# EAGLE design RCMX Rev_00_BPS (EAGLE 6.2)
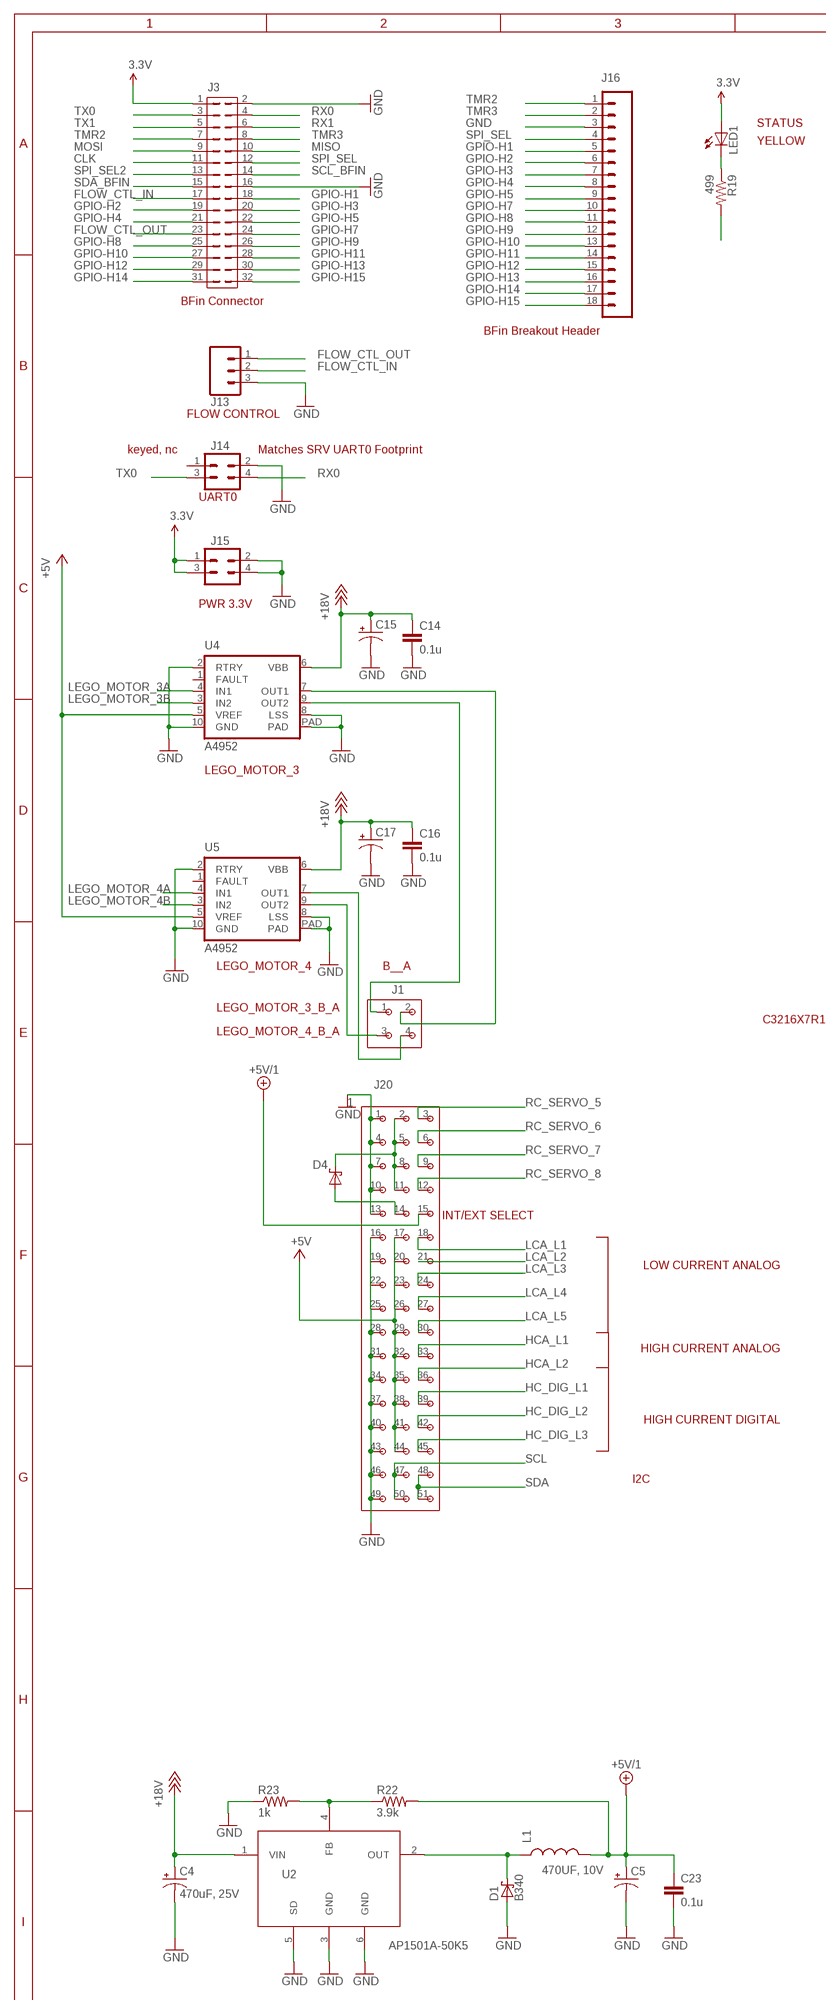
[diagram p0: schematic, sheet 1, part 1 of 2]
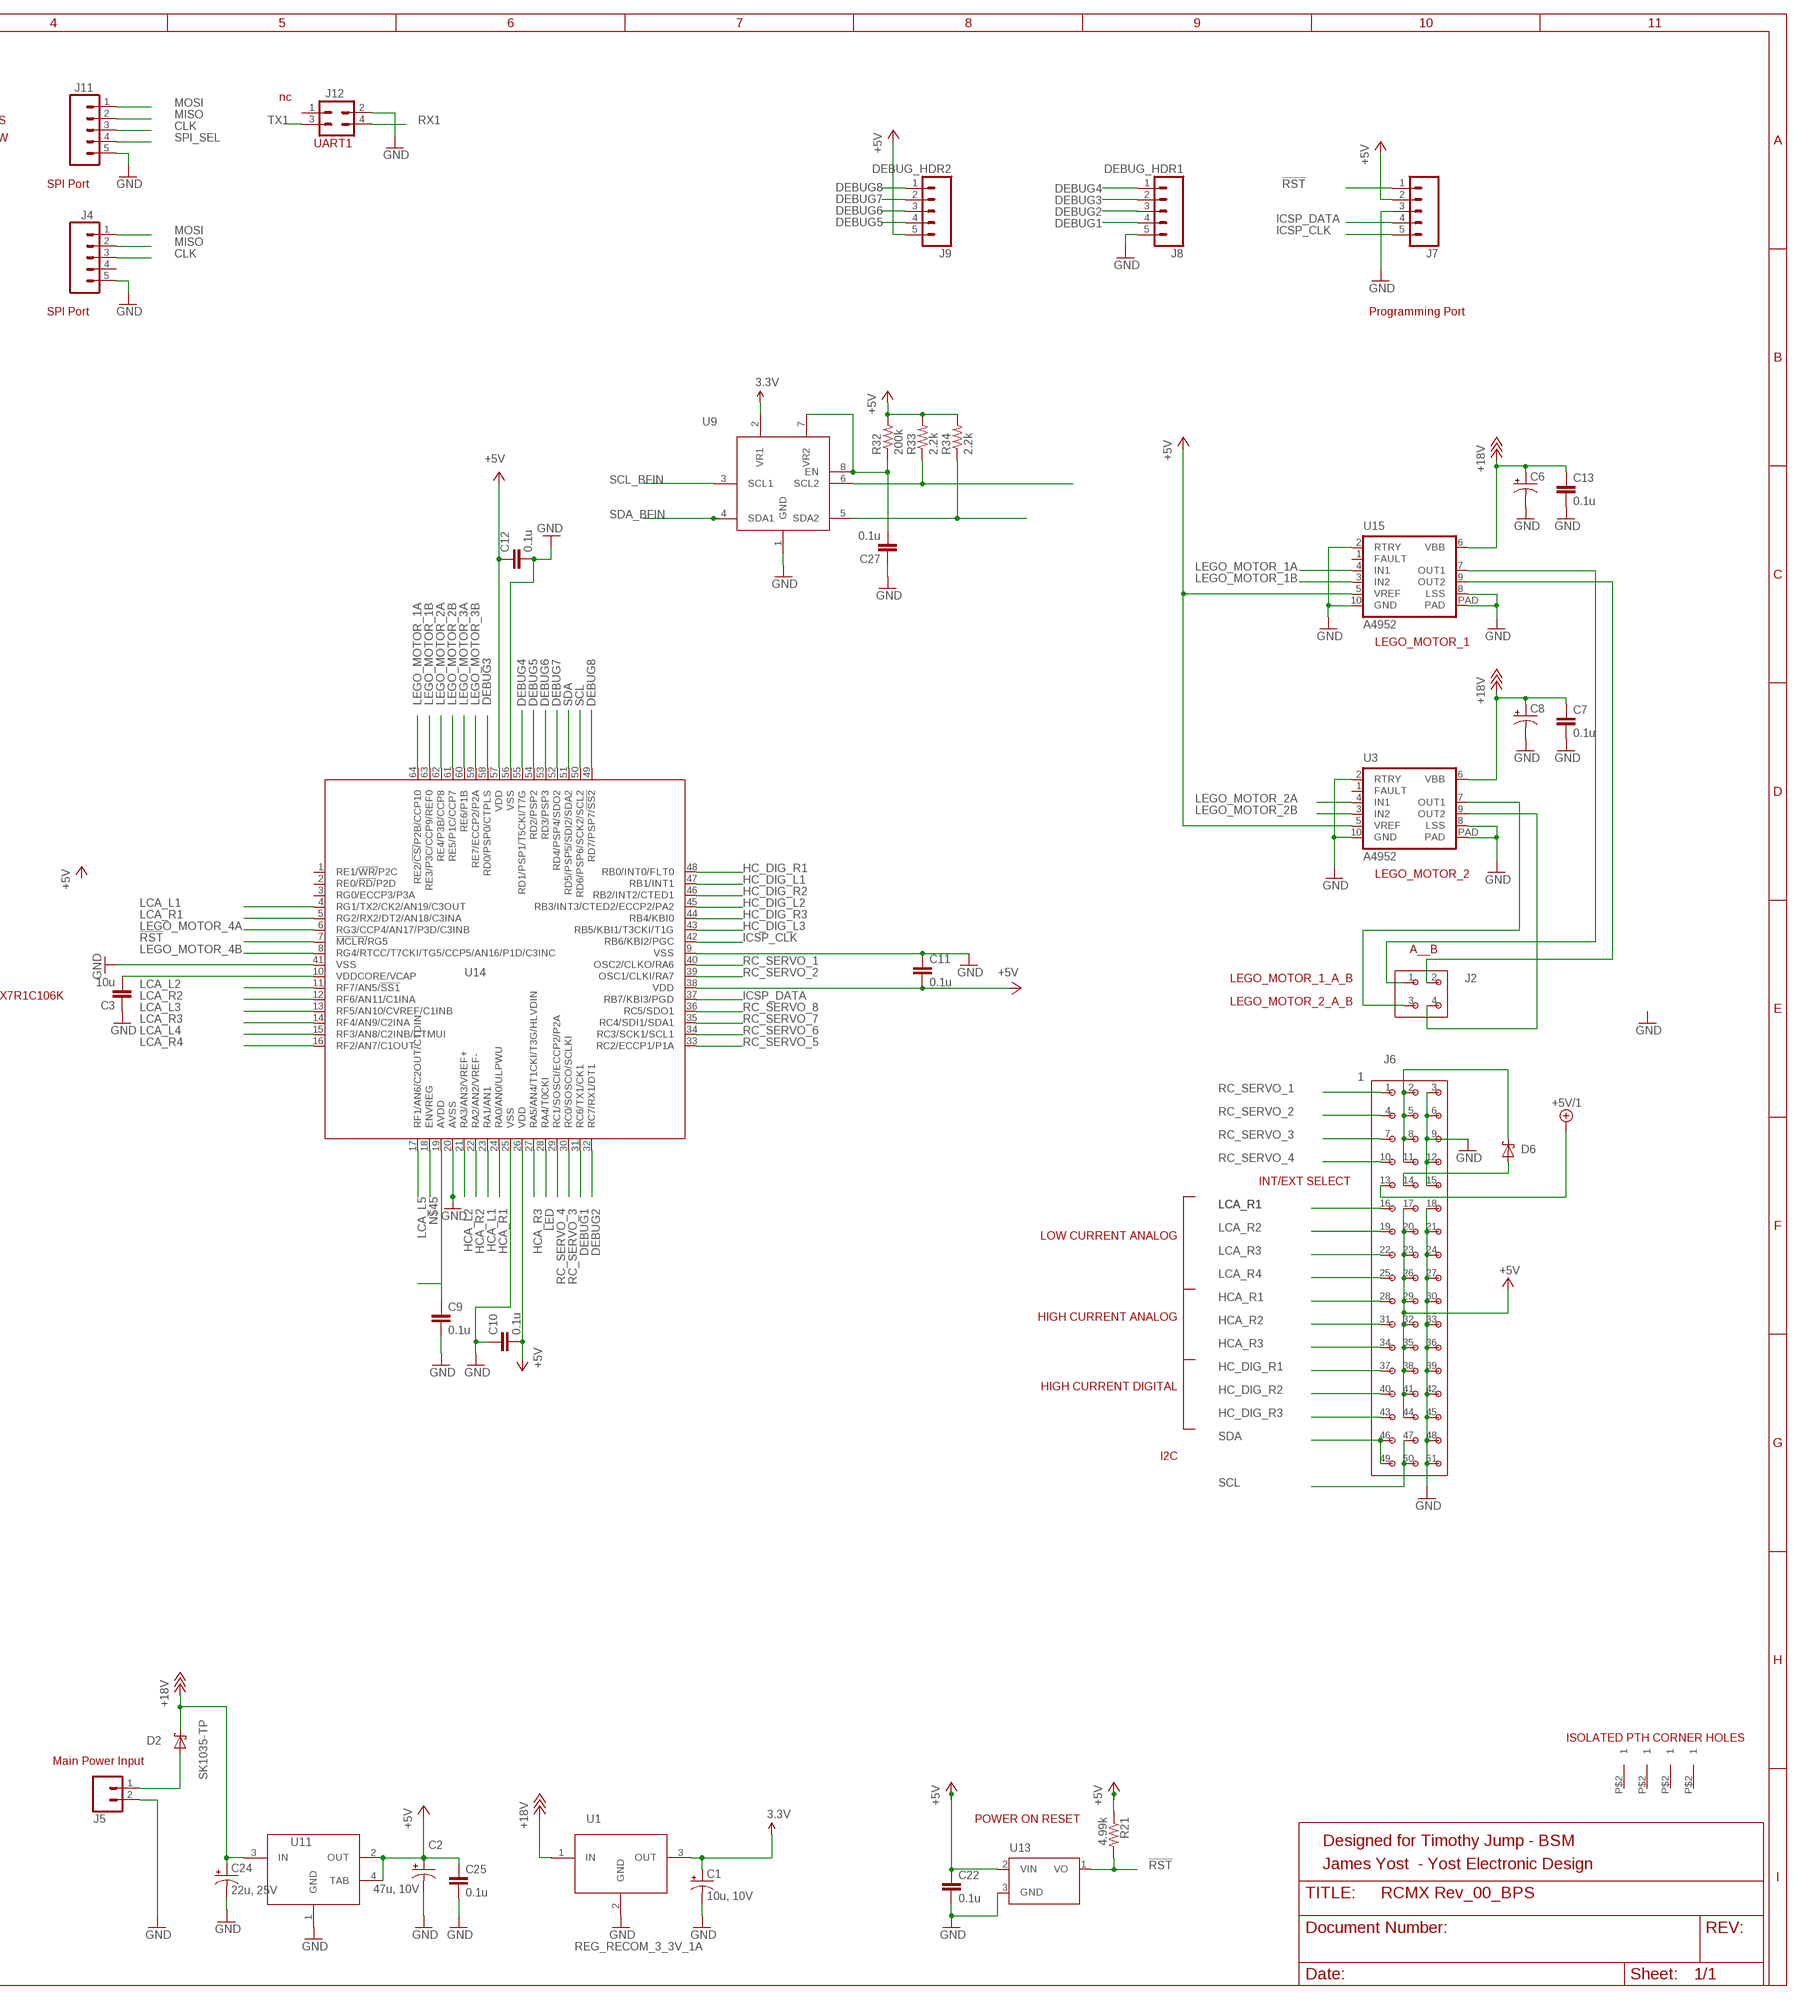
[diagram p1: schematic, sheet 1, part 2 of 2]

## Parts
C1  10u, 10V  CAP_POL1206  [EIA3216]
C2  47u, 10V  CAP_1210_POL  [CAP1210_POL]
C3  10u  CAP1206  [1206]
C4  470uF, 25V  CAP_POLG  [PANASONIC_G]
C5  470UF, 10V  CAP_ELT_PANASONIC_470UF  [PANASONIC_F]
C6  CAP_POLD  [PANASONIC_D]
C7  0.1u  CAP0805  [0805]
C8  CAP_POLD  [PANASONIC_D]
C9  0.1u  CAP0805  [0805]
C10  0.1u  CAP0805  [0805]
C11  0.1u  CAP0805  [0805]
C12  0.1u  CAP0805  [0805]
C13  0.1u  CAP0805  [0805]
C14  0.1u  CAP0805  [0805]
C15  CAP_POLD  [PANASONIC_D]
C16  0.1u  CAP0805  [0805]
C17  CAP_POLD  [PANASONIC_D]
C22  0.1u  CAP0805  [0805]
C23  0.1u  CAP0805  [0805]
C24  22u, 25V  CAP_1210_POL  [CAP1210_POL]
C25  0.1u  CAP0805  [0805]
C27  0.1u  CAP0805  [0805]
D1  B340  [SMA_DO214AC]
D2  SK1035-TP  [DO214AB]
D4  SK1035-TP  [DO214AB]
D6  SK1035-TP  [DO214AB]
J1  CON_2X2_0_100  [CON_2X2_0_100]
J2  CON_2X2_0_100  [CON_2X2_0_100]
J3  CON_2X16_0_100  [CON_2X16_0_100]
J4  M05PTH  [1X05]
J5  M02NG  [1X02]
J6  CON_3X17_0_100  [CON_3X17_0_100]
J7  M05PTH  [1X05]
J8  DEBUG_HDR1  M05PTH  [1X05]
J9  DEBUG_HDR2  M05PTH  [1X05]
J11  M05PTH  [1X05]
J12  CON2X2  [CON2X2]
J13  M03PTH  [1X03]
J14  CON2X2  [CON2X2]
J15  CON2X2  [CON2X2]
J16  CON1X18  [CON1X18]
J20  CON_3X17_0_100  [CON_3X17_0_100]
L1  IND_47UH_COILTRONICS_2_95A  [IND_PADS_SMT]
LED1  LEDCHIP-LED0805  [CHIP-LED0805]
R19  499  RESISTOR  [0805]
R21  4.99k  RESISTOR  [0805]
R22  3.9k  RESISTOR  [0805]
R23  1k  RESISTOR  [0805]
R32  200k  RESISTOR  [0805]
R33  2.2k  RESISTOR  [0805]
R34  2.2k  RESISTOR  [0805]
U1  REG_RECOM_3_3V_1A  [REG_RECOM_3_3V_1A]
U2  AP1501A-50K5  [TO263-5]
U3  A4952  [MSOP10_W_THERMAL_PAD]
U4  A4952  [MSOP10_W_THERMAL_PAD]
U5  A4952  [MSOP10_W_THERMAL_PAD]
U9  PCA9306DCT  [TEST08]
U11  TLV1117-5  [SOT223]
U13  MCP130T  [SOT23]
U14  MICRO_C_PIC18F65K22  [64PIN_TQFP_10X10X1MM]
U15  A4952  [MSOP10_W_THERMAL_PAD]
U$1  GNDPAD  [GNDPAD]
U$2  GNDPAD  [GNDPAD]
U$7  GNDPAD  [GNDPAD]
U$8  GNDPAD  [GNDPAD]

## Nets
3.3V: C1.A(+) J3.1 J15.1 J15.3 LED1.A U1.3(OUT) U9.2(VR1)
!RST: J7.1 R21.2 U13.1(VO) U14.7(!MCLR/!RG5)
+5V: C2.1(+) C10.2 C11.2 C12.1 C22.1 C25.1 J6.17 J6.20 J6.23 J6.26 J6.29 J6.32 J6.35 J6.38 J6.41 J6.44 J7.2 J9.5 J20.17 J20.20 J20.23 J20.26 J20.29 J20.32 J20.35 J20.38 J20.41 J20.44 R21.1 R32.2 R33.2 R34.2 U3.5(VREF) U4.5(VREF) U5.5(VREF) U11.2(OUT) U11.4(TAB) U13.2(VIN) U14.26(VDD) U14.38(VDD) U14.57(VDD) U15.5(VREF)
+5V/1: C5.+ C23.1 J6.13 J20.15 L1.2 R22.2
+18V: C4.+ C6.+ C7.1 C8.+ C13.1 C14.1 C15.+ C16.1 C17.+ C24.1(+) D2.1(C) U1.1(IN) U2.1(VIN) U3.6(VBB) U4.6(VBB) U5.6(VBB) U11.3(IN) U15.6(VBB)
CLK: J3.11 J4.3 J11.3
DEBUG1: J8.4 U14.31(RC6/TX1/CK1)
DEBUG2: J8.3 U14.32(RC7/RX1/DT1)
DEBUG3: J8.2 U14.58(RD0/PSP0/CTPLS)
DEBUG4: J8.1 U14.55(RD1/PSP1/T5CKI/T7G)
DEBUG5: J9.4 U14.54(RD2/PSP2)
DEBUG6: J9.3 U14.53(RD3/PSP3)
DEBUG7: J9.2 U14.52(RD4/PSP4/SDO2)
DEBUG8: J9.1 U14.49(RD7/PSP7/!SS2)
FLOW_CTL_IN: J3.17 J13.2
FLOW_CTL_OUT: J3.23 J13.1
GND: C1.C(-) C2.2(-) C3.1 C4.- C5.- C6.- C7.2 C8.- C9.2 C10.1 C11.1 C12.2 C13.2 C14.2 C15.- C16.2 C17.- C22.2 C23.2 C24.2(-) C25.2 C27.1 D1.A J3.2 J3.16 J4.5 J5.2 J6.3 J6.6 J6.9 J6.12 J6.15 J6.18 J6.21 J6.24 J6.27 J6.30 J6.33 J6.36 J6.39 J6.42 J6.45 J6.48 J6.51 J7.3 J8.5 J11.5 J12.2 J13.3 J14.2 J15.2 J15.4 J16.3 J20.1 J20.4 J20.7 J20.10 J20.13 J20.16 J20.19 J20.22 J20.25 J20.28 J20.31 J20.34 J20.37 J20.40 J20.43 J20.46 J20.49 R23.1 U1.2(GND) U2.3(GND) U2.5(SD) U2.6(GND) U3.2(RTRY) U3.8(LSS) U3.10(GND) U3.PAD U4.2(RTRY) U4.8(LSS) U4.10(GND) U4.PAD U5.2(RTRY) U5.8(LSS) U5.10(GND) U5.PAD U9.1(GND) U11.1(GND) U13.3(GND) U14.9(VSS) U14.20(AVSS) U14.25(VSS) U14.41(VSS) U14.56(VSS) U15.2(RTRY) U15.8(LSS) U15.10(GND) U15.PAD
GPIO-H1: J3.18 J16.5
GPIO-H2: J3.19 J16.6
GPIO-H3: J3.20 J16.7
GPIO-H4: J3.21 J16.8
GPIO-H5: J3.22 J16.9
GPIO-H7: J3.24 J16.10
GPIO-H8: J3.25 J16.11
GPIO-H9: J3.26 J16.12
GPIO-H10: J3.27 J16.13
GPIO-H11: J3.28 J16.14
GPIO-H12: J3.29 J16.15
GPIO-H13: J3.30 J16.16
GPIO-H14: J3.31 J16.17
GPIO-H15: J3.32 J16.18
HC_DIG_L1: J20.39 U14.47(RB1/INT1)
HC_DIG_L2: J20.42 U14.45(RB3/INT3/CTED2/ECCP2/PA2)
HC_DIG_L3: J20.45 U14.43(RB5/KBI1/T3CKI/T1G)
HC_DIG_R1: J6.37 U14.48(RB0/INT0/FLT0)
HC_DIG_R2: J6.40 U14.46(RB2/INT2/CTED1)
HC_DIG_R3: J6.43 U14.44(RB4/KBI0)
HCA_L1: J20.33 U14.23(RA1/AN1)
HCA_L2: J20.36 U14.21(RA3/AN3/VREF+)
HCA_R1: J6.28 U14.24(RA0/AN0/ULPWU)
HCA_R2: J6.31 U14.22(RA2/AN2/VREF-)
HCA_R3: J6.34 U14.27(RA5/AN4/T1CKI/T3G/HLVDIN)
ICSP_CLK: J7.5 U14.42(RB6/KBI2/PGC)
ICSP_DATA: J7.4 U14.37(RB7/KBI3/PGD)
LCA_L1: J20.18 U14.4(RG1/TX2/CK2/AN19/C3OUT)
LCA_L2: J20.21 U14.11(RF7/AN5/!SS1)
LCA_L3: J20.24 U14.13(RF5/AN10/CVREF/C1INB)
LCA_L4: J20.27 U14.15(RF3/AN8/C2INB/CTMUI)
LCA_L5: J20.30 U14.17(RF1/AN6/C2OUT/CTDIN)
LCA_R1: J6.16 U14.5(RG2/RX2/DT2/AN18/C3INA)
LCA_R2: J6.19 U14.12(RF6/AN11/C1INA)
LCA_R3: J6.22 U14.14(RF4/AN9/C2INA)
LCA_R4: J6.25 U14.16(RF2/AN7/C1OUT)
LED: U14.28(RA4/T0CKI)
LEGO_1A: J2.1 U15.7(OUT1)
LEGO_1B: J2.2 U15.9(OUT2)
LEGO_2A: J2.3 U3.7(OUT1)
LEGO_2B: J2.4 U3.9(OUT2)
LEGO_4A: J1.4 U5.7(OUT1)
LEGO_4B: J1.3 U5.9(OUT2)
LEGO_MOTOR_1A: U14.64(RE2/!CS/!P2B/CCP10) U15.4(IN1)
LEGO_MOTOR_1B: U14.63(RE3/P3C/CCP9/REF0) U15.3(IN2)
LEGO_MOTOR_2A: U3.4(IN1) U14.62(RE4/P3B/CCP8)
LEGO_MOTOR_2B: U3.3(IN2) U14.61(RE5/P1C/CCP7)
LEGO_MOTOR_3A: U4.4(IN1) U14.60(RE6/P1B)
LEGO_MOTOR_3B: U4.3(IN2) U14.59(RE7/ECCP2/P2A)
LEGO_MOTOR_4A: U5.4(IN1) U14.6(RG3/CCP4/AN17/P3D/C3INB)
LEGO_MOTOR_4B: U5.3(IN2) U14.8(RG4/RTCC/T7CKI/TG5/CCP5/AN16/P1D/C3INC)
MISO: J3.10 J4.2 J11.2
MOSI: J3.9 J4.1 J11.1
N$1: D1.C L1.1 U2.2(OUT)
N$3: D6.2(A) J6.14
N$5: R33.1 U9.6(SCL2)
N$6: D6.1(C) J6.2 J6.5 J6.8 J6.11
N$12: D4.1(C) J20.2 J20.5 J20.8 J20.11
N$14: R34.1 U9.5(SDA2)
N$18: C9.1 U14.19(AVDD)
N$26: D2.2(A) J5.1
N$31: J1.2 U4.7(OUT1)
N$32: J1.1 U4.9(OUT2)
N$34: R22.1 R23.2 U2.4(FB)
N$37: C3.2 U14.10(VDDCORE/VCAP)
N$39: D4.2(A) J20.14
N$40: C27.2 R32.1 U9.7(VR2) U9.8(EN)
N$42: LED1.C R19.1
N$43: R19.2
N$45: U14.18(ENVREG)
RC_SERVO_1: J6.1 U14.40(OSC2/CLKO/RA6)
RC_SERVO_2: J6.4 U14.39(OSC1/CLKI/RA7)
RC_SERVO_3: J6.7 U14.30(RC0/SOSCO/SCLKI)
RC_SERVO_4: J6.10 U14.29(RC1/SOSCI/ECCP2/P2A)
RC_SERVO_5: J20.3 U14.33(RC2/ECCP1/P1A)
RC_SERVO_6: J20.6 U14.34(RC3/SCK1/SCL1)
RC_SERVO_7: J20.9 U14.35(RC4/SDI1/SDA1)
RC_SERVO_8: J20.12 U14.36(RC5/SDO1)
RX0: J3.4 J14.4
RX1: J3.6 J12.4
SCL: J6.47 J6.50 J20.47 J20.50 U14.50(RD6/PSP6/SCK2/SCL2)
SCL_BFIN: J3.14 U9.3(SCL1)
SDA: J6.46 J6.49 J20.48 J20.51 U14.51(RD5/PSP5/SDI2/SDA2)
SDA_BFIN: J3.15 U9.4(SDA1)
SPI_SEL: J3.12 J11.4 J16.4
SPI_SEL2: J3.13
TMR2: J3.7 J16.1
TMR3: J3.8 J16.2
TX0: J3.3 J14.3
TX1: J3.5 J12.3
Unconnected: J4.4 J12.1 J14.1 U3.1(FAULT) U4.1(FAULT) U5.1(FAULT) U14.1(RE1/!WR/!P2C) U14.2(RE0/!RD/!P2D) U14.3(RG0/ECCP3/P3A) U15.1(FAULT) U$1.P$2 U$2.P$2 U$7.P$2 U$8.P$2

## Notes on the sheet
- nc
- STATUS
- YELLOW
- UART1
- SPI Port
- BFin Connector
- SPI Port | Programming Port
- BFin Breakout Header
- FLOW CONTROL
- keyed, nc | Matches SRV UART0 Footprint
- UART0
- PWR 3.3V
- LEGO_MOTOR_1
- LEGO_MOTOR_3
- LEGO_MOTOR_2
- LEGO_MOTOR_4 | B__A
- A__B
- LEGO_MOTOR_1_A_B
- LEGO_MOTOR_3_B_A
- C3216X7R1C106K
- LEGO_MOTOR_2_A_B
- LEGO_MOTOR_4_B_A
- INT/EXT SELECT
- INT/EXT SELECT
- LOW CURRENT ANALOG | LOW CURRENT ANALOG
- HIGH CURRENT ANALOG | HIGH CURRENT ANALOG
- HIGH CURRENT DIGITAL | HIGH CURRENT DIGITAL
- I2C
- I2C
- ISOLATED PTH CORNER HOLES
- Main Power Input
- POWER ON RESET
- Designed for Timothy Jump - BSM
- James Yost  - Yost Electronic Design

## Library data of the parts
C1 C4 = SparkFun:CAP_POL: Capacitor Polarized These are standard SMD and PTH capacitors. Normally 10uF, 47uF, and 100uF in electrolytic and tantalum varieties. Always verify the external diameter of the through hole cap, it varies with capacity, voltage, and manufacturer. The EIA devices should be standard.
C2 C24 = JLY Parts:CAP_1210_POL: Polarized Capacitor, 1210 Size, SMT
C3 = SparkFun-Passives:CAP: Capacitor Standard 0603 ceramic capacitor, and 0.1" leaded capacitor.
C5 = JLY Parts:CAP_ELT_PANASONIC_470UF: 470UF 10V ELECT, Panasonic - ECG, EEE-FP1A471AP, Digikey PCE4526CT-ND
C6 C8 C15 C17 = SparkFun-Passives:CAP_POL: Capacitor Polarized These are standard SMD and PTH capacitors. Normally 10uF, 47uF, and 100uF in electrolytic and tantalum varieties. Always verify the external diameter of the through hole cap, it varies with capacity, voltage, and manufacturer. The EIA devices should be standard.
C7 C9-C14 C16 C22 C23 C25 C27 = SparkFun:CAP: Capacitor Standard 0603 ceramic capacitor, and 0.1" leaded capacitor.
D1 = JLY Parts:B340
D2 D4 D6 = JLY Parts:SK1035-TP: DIODE SCHOTTKY 10A 35V DO-214AB, Micro Commercial Co, Digikey SK1035-TPCT-ND
J1 J2 = JLY Parts_V_5_11:CON_2X2_0_100
J3 = JLY Parts:CON_2X16_0_100
J4 J11 = SparkFun:M05: Header 5 Standard 5-pin 0.1" header. Use with straight break away headers (SKU : PRT-00116), right angle break away headers (PRT-00553), swiss pins (PRT-00743), machine pins (PRT-00117), and female headers (PRT-00115). Molex polarized connector foot print use with SKU : PRT-08230 with associated crimp pins and housings.
J5 = SparkFun:M02NG
J6 J20 = JLY Parts_V_5_11:CON_3X17_0_100
J7-J9 = SparkFun-Connectors:M05: Header 5 Standard 5-pin 0.1" header. Use with straight break away headers (SKU : PRT-00116), right angle break away headers (PRT-00553), swiss pins (PRT-00743), machine pins (PRT-00117), and female headers (PRT-00115). Molex polarized connector foot print use with SKU : PRT-08230 with associated crimp pins and housings.
J12 J14 J15 = JLY Parts:CON2X2
J13 = SparkFun:M03: Header 3 Standard 3-pin 0.1" header. Use with straight break away headers (SKU : PRT-00116), right angle break away headers (PRT-00553), swiss pins (PRT-00743), machine pins (PRT-00117), and female headers (PRT-00115). Molex polarized connector foot print use with SKU : PRT-08232 with associated crimp pins and housings.
J16 = JLY Parts:CON1X18: Connector 1x18 with 0.1" spacing
L1 = JLY Parts:IND_47UH_COILTRONICS_2_95A: 47UH SMD DR Coiltronics, DR127-470-R, Digikey 513-1050-6-ND, INDUCTOR SHIELD
LED1 = led:LED: LED OSRAM: - CHIPLED LG R971, LG N971, LY N971, LG Q971, LY Q971, LO R971, LY R971 LH N974, LH R974 LS Q976, LO Q976, LY Q976 LO Q996 - Hyper CHIPLED LW Q18S LB Q993, LB Q99A, LB R99A - SideLED LS A670, LO A670, LY A670, LG A670, LP A670 LB A673, LV A673, LT A673, LW A673 LH A674 LY A675 LS A676, LA A676, LO A676, LY A676, LW A676 LS A679, LY A679, LG A679 - Hyper Micro SIDELED® LS Y876, LA Y876, LO Y876, LY Y876 LT Y87S - SmartLED LW L88C, LW L88S LB L89C, LB L89S, LG L890 LS L89K, LO L89K, LY L89K LS L896, LA L896, LO L896, LY L896 - TOPLED LS T670, LO T670, LY T670, LG T670, LP T670 LSG T670, LSP T670, LSY T670, LOP T670, LYG T670 LG T671, LOG T671, LSG T671 LB T673, LV T673, LT T673, LW T673 LH T674 LS T676, LA T676, LO T676, LY T676, LB T676, LH T676, LSB T676, LW T676 LB T67C, LV T67C, LT T67C, LS T67K, LO T67K, LY T67K, LW E67C LS E67B, LA E67B, LO E67B, LY E67B, LB E67C, LV E67C, LT E67C LW T67C LS T679, LY T679, LG T679 LS T770, LO T770, LY T770, LG T770, LP T770 LB T773, LV T773, LT T773, LW T773 LH T774 LS E675, LA E675, LY E675, LS T675 LS T776, LA T776, LO T776, LY T776, LB T776 LHGB T686 LT T68C, LB T68C - Hyper Mini TOPLED® LB M676 - Mini TOPLED Santana® LG M470 LS M47K, LO M47K, LY M47K Source: http://www.osram.convergy.de LUXEON: - LUMILED® LXK2-PW12-R00, LXK2-PW12-S00, LXK2-PW14-U00, LXK2-PW14-V00 LXK2-PM12-R00, LXK2-PM12-S00, LXK2-PM14-U00 LXK2-PE12-Q00, LXK2-PE12-R00, LXK2-PE12-S00, LXK2-PE14-T00, LXK2-PE14-U00 LXK2-PB12-K00, LXK2-PB12-L00, LXK2-PB12-M00, LXK2-PB14-N00, LXK2-PB14-P00, LXK2-PB14-Q00 LXK2-PR12-L00, LXK2-PR12-M00, LXK2-PR14-Q00, LXK2-PR14-R00 LXK2-PD12-Q00, LXK2-PD12-R00, LXK2-PD12-S00 LXK2-PH12-R00, LXK2-PH12-S00 LXK2-PL12-P00, LXK2-PL12-Q00, LXK2-PL12-R00 Source: www.luxeon.com KINGBRIGHT: KA-3528ASYC Source: www.kingbright.com
R19 R21-R23 R32-R34 = SparkFun:RESISTOR: Resistor Basic schematic elements and footprints for 0603, 1206, and PTH 1/10th watt (small) resistors.
U1 = JLY Parts:REG_RECOM_3_3V_1A: REG DC/DC 1A 3.3V OUT SIP VERT Innoline R-78-1.0 Recom Power Inc, Digikey 945-1036-ND
U2 = JLY Parts:AP1501A-50K5: Buck Regulator 5V, Diodes Inc, AP1501A-50K5L-1, Digikey AP1501A-50K5LDICT-ND, DC-DC 5A 5.0V TO263-5L
U3-U5 U15 = JLY_Parts:A4952: PWM Motor Driver, A4952, Allegro A4952ELYTR-T, Digikey 620-1451-1-ND, MSOP10 pkg
U9 = JLY Parts:PCA9306DCT
U11 = JLY Parts:TLV1117-5
U13 = JLY Parts:MCP130T
U14 = JLY_Parts:MICRO_C_PIC18F65K22: Micro_C, PIC18F65K22, 64PIN_TQFP
U$1 U$2 U$7 U$8 = JLY Parts:GNDPAD: Pad, round, 0.125 ID, 0.250 OD

## Board
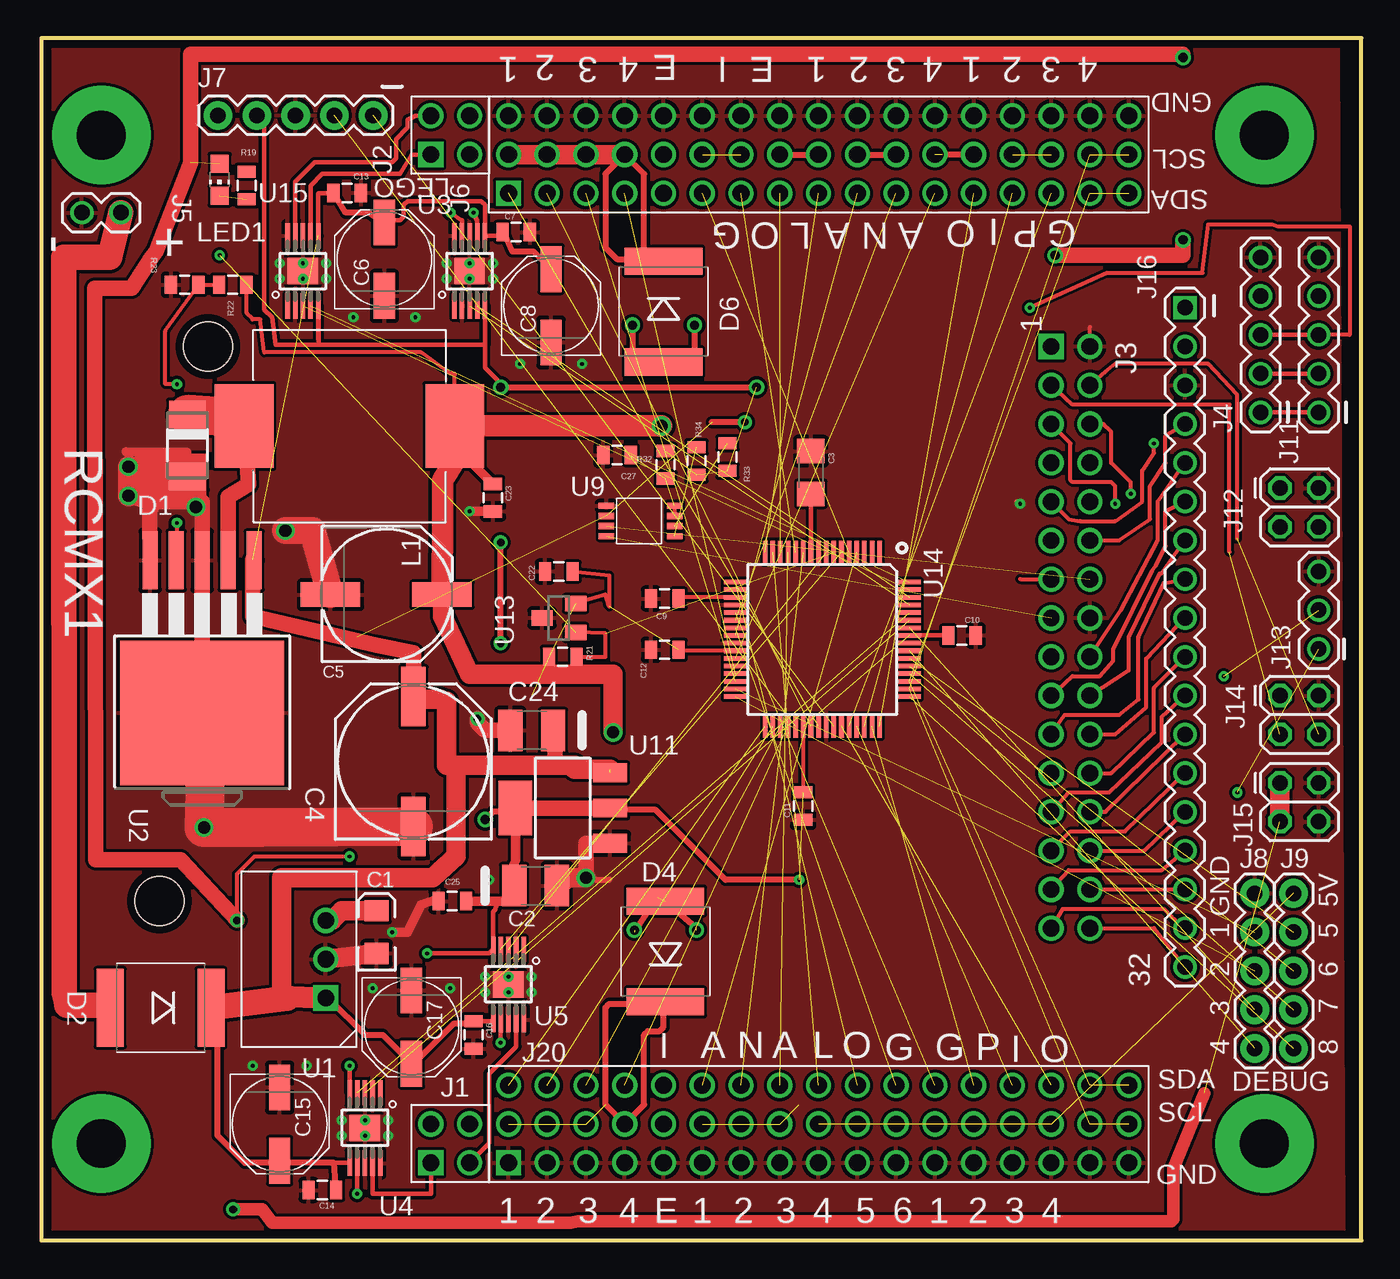
[diagram p2: board, top side]
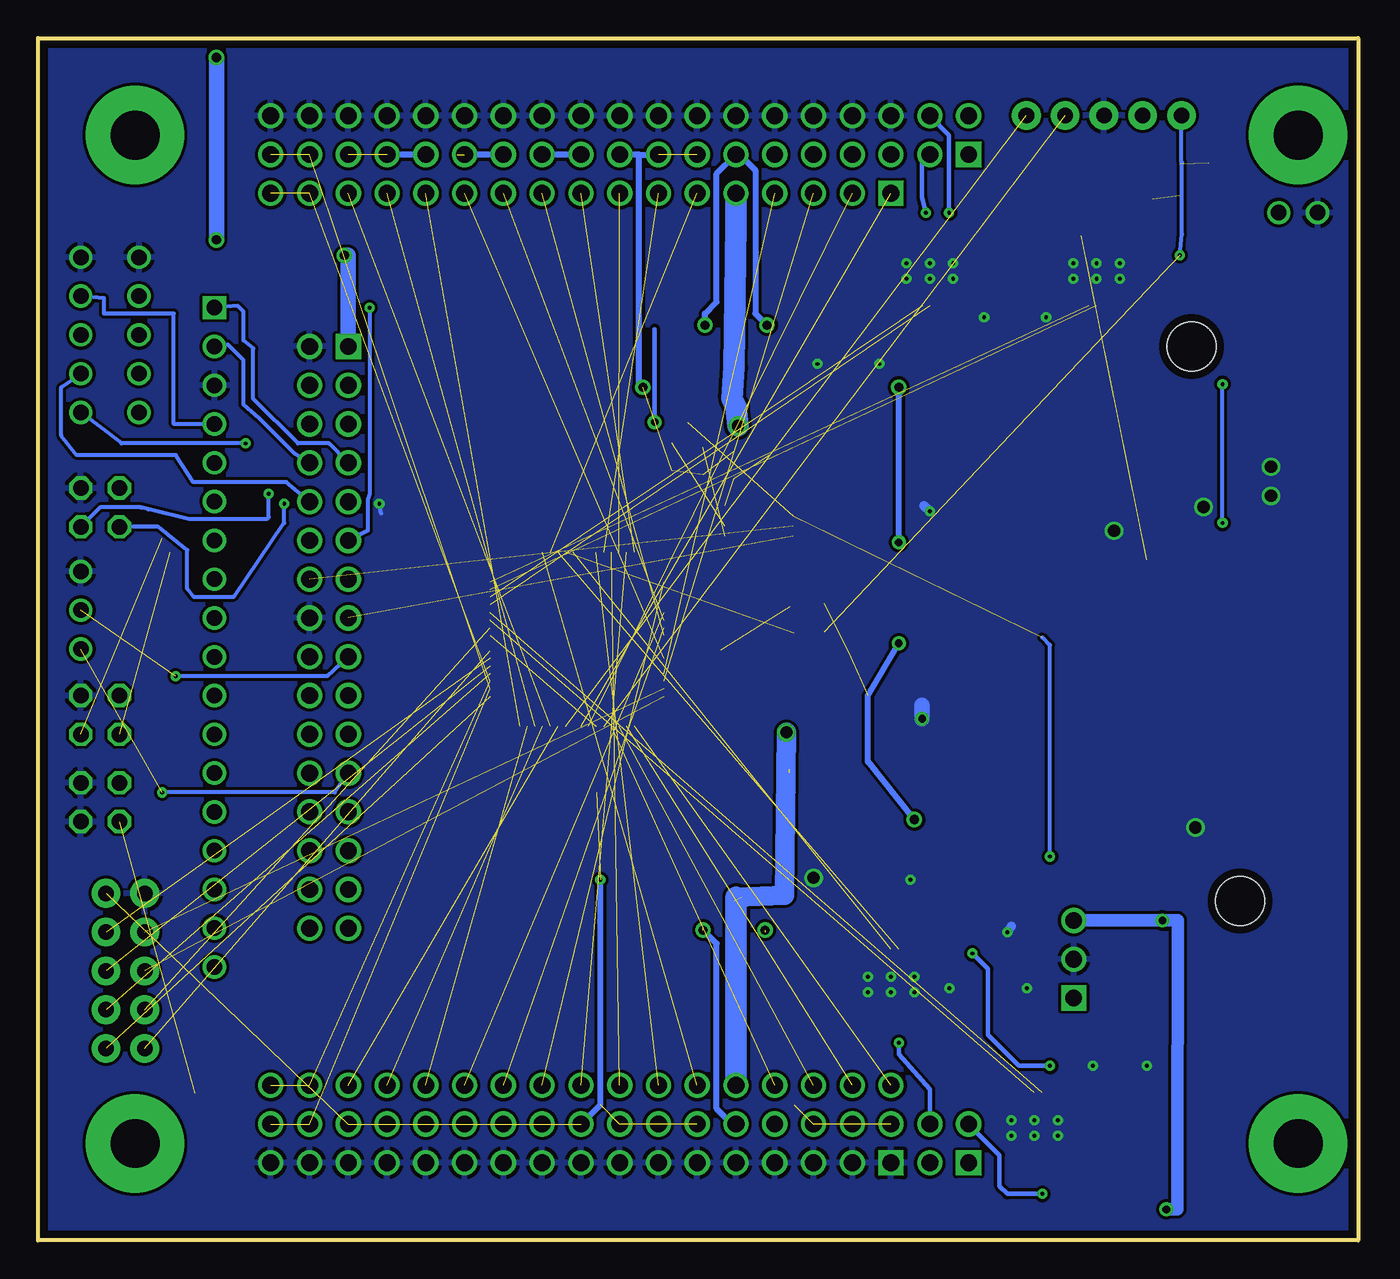
[diagram p3: board, bottom side, seen from below]

Size 86.49 x 78.74 mm. Coordinates in mm from the lower left corner, seen from the top.
Outline: 86.49,0 86.49,78.74 0,78.74 0,0 86.49,0
Copper layers (1*16): Top 0.035mm / dielectric 1.5mm / Bottom 0.035mm
Design rules "default": minimum track width 10mil, minimum drill 24mil, track to track 8mil, track to pad 8mil, pad to pad 8mil, via to via 8mil, smd to smd 8mil, copper to edge 20mil, drill to drill 8mil, minimum pad ring 10mil, minimum via ring 8mil, stop-mask expansion 4mil, vias tented up to drill 0mil, thermal gap 10mil
Holes 3.2 mm at 7.75,22.23 10.92,58.55

### Footprints (pad centres in the part's own frame; a part is rotated, then mirrored left to right if it is on the bottom)
EIA3216 = smd 1.4 x 1.6: A 1.4,0; C -1.4,0
CAP1210_POL = smd 1.6 x 2.7: 1 -1.4,0; 2 1.4,0
1206 = smd 1.6 x 1.8: 1 -1.4,0; 2 1.4,0
PANASONIC_G = smd 3.9 x 1.6: + 4.25,0; - -4.25,0
PANASONIC_F = smd 3.9 x 1.6: + 3.65,0; - -3.65,0
PANASONIC_D = smd 3 x 1.4: + 2.4,0; - -2.4,0
0805 = smd 0.8 x 1.2: 1 -0.9,0; 2 0.9,0
SMA_DO214AC = smd 1.8 x 2.4: A 2.025,0; C -2.025,0
DO214AB = smd 1.778 x 5.08: 1 -3.302,0; 2 3.302,0
CON_2X2_0_100 = drill 1.1 square: 1 -1.27,1.27 | drill 1.1: 2 1.27,1.27; 3 -1.27,-1.27; 4 1.27,-1.27
CON_2X16_0_100 = drill 1.1 square: 1 -1.27,20.32 | drill 1.1: 2 1.27,20.32; 3 -1.27,17.78; 4 1.27,17.78; 5 -1.27,15.24; 6 1.27,15.24; 7 -1.27,12.7; 8 1.27,12.7; 9 -1.27,10.16; 10 1.27,10.16; 11 -1.27,7.62; 12 1.27,7.62; 13 -1.27,5.08; 14 1.27,5.08; 15 -1.27,2.54; 16 1.27,2.54; 17 -1.27,0; 18 1.27,0; 19 -1.27,-2.54; 20 1.27,-2.54; 21 -1.27,-5.08; 22 1.27,-5.08; 23 -1.27,-7.62; 24 1.27,-7.62; 25 -1.27,-10.16; 26 1.27,-10.16; 27 -1.27,-12.7; 28 1.27,-12.7; 29 -1.27,-15.24; 30 1.27,-15.24; 31 -1.27,-17.78; 32 1.27,-17.78
1X05 = drill 1.016: 1 0,0; 2 2.54,0; 3 5.08,0; 4 7.62,0; 5 10.16,0
1X02 = drill 1.016: 1 0,0; 2 2.54,0
CON_3X17_0_100 = drill 1.1 square: 1 -2.54,20.32 | drill 1.1: 2 0,20.32; 3 2.54,20.32; 4 -2.54,17.78; 5 0,17.78; 6 2.54,17.78; 7 -2.54,15.24; 8 0,15.24; 9 2.54,15.24; 10 -2.54,12.7; 11 0,12.7; 12 2.54,12.7; 13 -2.54,10.16; 14 0,10.16; 15 2.54,10.16; 16 -2.54,7.62; 17 0,7.62; 18 2.54,7.62; 19 -2.54,5.08; 20 0,5.08; 21 2.54,5.08; 22 -2.54,2.54; 23 0,2.54; 24 2.54,2.54; 25 -2.54,0; 26 0,0; 27 2.54,0; 28 -2.54,-2.54; 29 0,-2.54; 30 2.54,-2.54; 31 -2.54,-5.08; 32 0,-5.08; 33 2.54,-5.08; 34 -2.54,-7.62; 35 0,-7.62; 36 2.54,-7.62; 37 -2.54,-10.16; 38 0,-10.16; 39 2.54,-10.16; 40 -2.54,-12.7; 41 0,-12.7; 42 2.54,-12.7; 43 -2.54,-15.24; 44 0,-15.24; 45 2.54,-15.24; 46 -2.54,-17.78; 47 0,-17.78; 48 2.54,-17.78; 49 -2.54,-20.32; 50 0,-20.32; 51 2.54,-20.32
1X05' = drill 1.016 pad 1.88: 1 0,0; 2 2.54,0; 3 5.08,0; 4 7.62,0; 5 10.16,0
CON2X2 = drill 1.016 octagon: 1 -1.27,-1.27; 2 -1.27,1.27; 3 1.27,-1.27; 4 1.27,1.27
1X03 = drill 1.016: 1 0,0; 2 2.54,0; 3 5.08,0
CON1X18 = drill 1.016 square: 1 -20.32,0 | drill 1.016: 2 -17.78,0; 3 -15.24,0; 4 -12.7,0; 5 -10.16,0; 6 -7.62,0; 7 -5.08,0; 8 -2.54,0; 9 0,0; 10 2.54,0; 11 5.08,0; 12 7.62,0; 13 10.16,0; 14 12.7,0; 15 15.24,0; 16 17.78,0; 17 20.32,0; 18 22.86,0
IND_PADS_SMT = smd 3.85 x 5.5: 1 -6.9,0; 2 6.9,0
CHIP-LED0805 = smd 1.2 x 1.2: A 0,-1.05; C 0,1.05
REG_RECOM_3_3V_1A = drill 1.1 square: 1 -2.54,-1.75 | drill 1.1: 2 0,-1.75; 3 2.54,-1.75
TO263-5 = smd 1 x 3.8: 1 -3.4,-10; 2 -1.7,-10; 3 0,-10; 4 1.7,-10; 5 3.4,-10 | smd 10.75 x 9.45: 6 0,0
MSOP10_W_THERMAL_PAD = smd 0.3 x 1.65: 1 -1,-2.3; 2 -0.5,-2.3; 3 0,-2.3; 4 0.5,-2.3; 5 1,-2.3; 6 1,2.3; 7 0.5,2.3; 8 0,2.3; 9 -0.5,2.3; 10 -1,2.3 | smd 1.98 x 1.73: PAD 0,0
TEST08 = smd 0.406 x 1.016: 1 -0.991,-1.956; 2 -0.33,-1.956; 3 0.33,-1.956; 4 0.991,-1.956; 5 0.991,2.515; 6 0.33,2.515; 7 -0.33,2.515; 8 -0.991,2.515
SOT223 = smd 1.219 x 2.235: 1 -2.311,-3.099; 2 0,-3.099; 3 2.311,-3.099 | smd 3.6 x 2.2: 4 0,3.099
SOT23 = smd 1 x 1.4: 1 -0.95,-1.1; 2 0.95,-1.1; 3 0,1.1
64PIN_TQFP_10X10X1MM = smd 1.5 x 0.3: 1 -5.7,4; 2 -5.7,3.5; 3 -5.7,3; 4 -5.7,2.5; 5 -5.7,2; 6 -5.7,1.5; 7 -5.7,1; 8 -5.7,0.5; 9 -5.7,0; 10 -5.7,-0.5; 11 -5.7,-1; 12 -5.7,-1.5; 13 -5.7,-2; 14 -5.7,-2.5; 15 -5.7,-3; 16 -5.7,-3.5; 33 5.7,-3.5; 34 5.7,-3; 35 5.7,-2.5; 36 5.7,-2; 37 5.7,-1.5; 38 5.7,-1; 39 5.7,-0.5; 40 5.7,0; 41 5.7,0.5; 42 5.7,1; 43 5.7,1.5; 44 5.7,2; 45 5.7,2.5; 46 5.7,3; 47 5.7,3.5; 48 5.7,4 | smd 0.3 x 1.5: 17 -3.75,-5.45; 18 -3.25,-5.45; 19 -2.75,-5.45; 20 -2.25,-5.45; 21 -1.75,-5.45; 22 -1.25,-5.45; 23 -0.75,-5.45; 24 -0.25,-5.45; 25 0.25,-5.45; 26 0.75,-5.45; 27 1.25,-5.45; 28 1.75,-5.45; 29 2.25,-5.45; 30 2.75,-5.45; 31 3.25,-5.45; 32 3.75,-5.45; 49 3.75,5.95; 50 3.25,5.95; 51 2.75,5.95; 52 2.25,5.95; 53 1.75,5.95; 54 1.25,5.95; 55 0.75,5.95; 56 0.25,5.95; 57 -0.25,5.95; 58 -0.75,5.95; 59 -1.25,5.95; 60 -1.75,5.95; 61 -2.25,5.95; 62 -2.75,5.95; 63 -3.25,5.95; 64 -3.75,5.95
GNDPAD = drill 3.2 pad 6.452: P$2 0,0

### Placement (x,y rotation side)
C1  21.97,20.19 90 top
C2  32.39,23.24 0 top
C3  50.42,50.29 270 top
C4  24.38,31.37 90 top
C5  22.61,42.29 0 top
C6  22.48,64.26 90 top
C7  31.11,66.04 0 top
C8  33.4,61.21 90 top
C9  40.84,42.04 180 top
C10  60.33,39.62 180 top
C11  49.91,28.45 90 top
C12  40.84,38.68 180 top
C13  20.04,68.61 0 top
C14  18.41,3.3 180 top
C15  15.62,7.62 270 top
C16  28.32,13.46 270 top
C17  24.26,13.97 270 top
C22  33.91,43.81 180 top
C23  29.59,48.64 270 top
C24  32.13,33.4 180 top
C25  26.92,22.23 180 top
C27  37.72,51.44 0 top
D1  9.58,52.07 270 top
D2  7.82,15.24 180 top
D4  40.89,18.92 90 top
D6  40.77,60.83 270 top
J1  26.8,6.35 90 top
J2  26.8,72.39 90 top
J3  67.44,38.23 0 top
J4  79.88,54.23 90 top
J5  5.21,67.31 180 top
J6  50.93,71.12 90 top
J7  [1X05']  11.58,73.69 0 top
J8  DEBUG_HDR1  [1X05']  79.5,12.57 90 top
J9  DEBUG_HDR2  [1X05']  82.04,12.57 90 top
J11  83.69,54.23 90 top
J12  82.42,48.01 270 top
J13  83.69,38.73 90 top
J14  82.42,34.42 270 top
J15  82.42,28.7 270 top
J16  74.93,40.77 270 top
J20  50.93,7.62 90 top
L1  20.19,53.34 0 top
LED1  11.68,69.47 180 top
R19  13.46,69.09 90 top
R21  34.16,38.23 0 top
R22  12.55,62.59 0 top
R23  9.4,62.59 0 top
R32  40.89,50.8 90 top
R33  44.96,51.31 270 top
R34  42.93,51.05 270 top
U1  16.89,18.41 90 top
U2  10.54,34.54 180 top
U3  28.07,63.5 0 top
U4  21.21,7.37 180 top
U5  30.61,16.76 180 top
U9  38.99,47.12 270 top
U11  34.16,28.32 90 top
U13  33.91,40.77 90 top
U14  50.93,39.37 270 top
U15  17.14,63.5 0 top
U$1  3.94,6.35 0 top
U$2  3.94,72.39 0 top
U$7  80.14,72.39 90 top
U$8  80.14,6.35 90 top

### Tracks (layer width: path | path; a pad name or v marks a point on that pad's centre or on a via)
3.3V  (via drill 0.25, 0.5, 0.6)  (4 unrouted)
  Top 0.254: v20.19,25.15 13.97,25.15 12.83,24 v12.83,20.95
  Top 0.406: v46.1,53.59 43.94,53.59
  Top 0.813: v12.57,2.03 14.48,2.03 15.11,1.14 34.67,1.14 35.18,1.27 74.04,1.27 74.17,1.4 74.17,4.7 76.2,9.65
  Top 1.016: v12.83,20.95 9.12,24.92 3.56,24.92 3.56,28.32 3.56,28.35 3.56,29.46 3.53,40.03 3.5,62.36 5.92,62.36 7.24,64.39 7.54,64.77 9.8,70.59 9.78,70.59 9.78,77.7 74.8,77.7 v74.8,77.47 | v74.8,65.53 74.8,64.52 v66.42,64.52
  Top 1.27: C1.A 19.68,21.59 19.05,20.95 U1.3 | J15.3 J15.1
  Bottom 0.254: v20.19,25.15 20.19,38.99 20.7,39.5
  Bottom 0.305: 46.1,59.69 v46.1,53.59
  Bottom 0.813: v12.57,2.03 11.84,2.03 11.84,4.7 11.81,20.95 v12.83,20.95 U1.3
  Bottom 1.016: v74.8,77.47 v74.8,65.53 | v66.42,64.52 66.17,64.52 J3.1
!RST  (via drill 0.25 pad 0.25)  (2 unrouted)
  Top 0.254: R21.2 36.96,38.23 36.96,39.75 U13.1
  Bottom 0.254: v11.68,64.52 11.56,65.91 11.56,70.61 11.58,70.61 J7.1
+5V  (via drill 0.25, 0.5, 0.5 pad 0.61, 0.6, 0.61)  (21 unrouted)
  Top 0.254: U11.4 30.61,28.07 | C22.1 37.21,43.56 37.21,41.53 36.96,42.29 U13.2 | U14.38 49.91,33.67 C11.2 | U14.26 41.87,38.62 C12.1
  Top 0.305: v30.1,55.88 30.1,56.13 29.08,57.15 29.08,58.67 | 29.08,58.67 29.08,61.18 U3.5 29.07,59.2 29.08,58.67 | 29.08,58.67 18.16,58.67 | 18.16,58.67 18.16,61.18 U15.5 18.14,59.2 18.16,58.67 | 18.16,58.67 15.37,58.67 15.11,60.45 14.61,60.96 14.61,73.2 J7.2 | U4.5 20.21,11.41 v20.19,11.43 | v25.27,18.8 29.34,18.8 U5.5 29.61,21.52 29.77,21.68 29.8,21.93 30.1,22.23 | U14.57 C10.2
  Top 0.406: v29.08,27.56 29.59,28.07 30.61,28.07 | v30.1,39.12 v30.1,45.72 | v30.1,55.88 v46.86,55.88 | J6.23 J6.26 | J6.29 J6.32 | J6.38 J6.35 | v49.66,23.62 44.83,23.62 40.26,28.19 37.39,28.19 U11.2
  Top 0.61: U11.4 31.06,24.89 30.98,24.64 C2.1 31.11,22.36 30.1,22.23 29.34,22.23 C25.1
  Top 1.016: U11.4 U11.2
  Bottom 0.305: v20.19,11.43 22.22,11.43 24.26,13.46 24.26,17.78 v25.27,18.8
  Bottom 0.406: v30.1,39.12 32.13,35.69 32.13,31.37 v29.08,27.56 | v30.1,45.72 v30.1,55.88 | v46.86,55.88 47.12,55.88 47.12,71.12 | 47.12,71.12 J6.20 | 47.12,71.12 J6.23 | J6.26 J6.29 | J6.32 59.05,71.12 | J6.38 J6.41 | J20.26 49.66,8.89 v49.66,23.62
+5V/1  (via drill 0.8, 0.8 pad 1.27)
  Top 0.254: L1.2 27.09,56.73 27.05,56.77 26.8,56.77 24.89,58.17 14.61,58.17 14.35,60.33 13.84,60.33 13.84,60.35 13.46,60.73 13.46,62.57 R22.2
  Top 0.61: C23.1 27.17,51.96 27.17,52.65
  Top 1.27: C5.+ 26.29,40.89 28.07,37.08 37.47,37.08 v37.47,33.27
  Top 1.422: C5.+ 26.29,47.75 26.29,49.78 27.3,51.44 27.17,52.65 L1.2 v40.64,53.34
  Bottom 1.27: 40.77,22.48 37.59,22.61 v37.47,33.27
  Bottom 1.422: v40.64,53.34 40.77,54.61 41.02,55.12 40.89,57.17 40.77,66.57 J6.13 | 40.77,22.48 J20.15
+18V  (2 unrouted)
  Top 0.305: C7.1 30.21,65.8 U3.6 29.07,67.83 28.83,68.07 24,68.07 23.75,67.82 23.75,67.06 23.49,66.8 22.62,66.8 C6.+ | C13.1 18.86,68.58 18.16,68.58 18.14,68.56 U15.6 | 20.18,5.07 U4.6 20.2,5.08 19.18,5.08 | C16.1 29.5,14.36 U5.6
  Top 0.406: C7.1 30.35,65.9 30.86,64.77 32.25,64.77 C8.+ | C6.+ 22.36,66.66 21.46,67.31 19.95,67.31 C13.1 | C14.1 19.18,5.08 15.76,5.08 C15.+ 15.51,4.32 15.62,5.08 13.34,5.08 11.56,6.86 11.56,14.81 D2.1 | U1.1 18.8,15.88 21.21,13.46 22.36,13.46 C17.+ 24.4,11.57 27.05,14.22 28.18,14.22 C16.1
  Top 1.016: U2.1 13.84,44.58 13.84,40.89 21.97,38.99 24.38,38.48 C4.+ 24.57,35.43 | C24.1 33.66,33.28 33.66,31.11 | 26.54,35.31 26.16,35.43
  Top 1.27: 15.75,16 15.75,23.75 25.65,23.75 27.18,25.15 27.18,30.99 26.8,31.11 | 37.26,30.86 34.93,30.86 34.93,31.11 33.66,31.11 26.8,31.11 | 26.8,31.11 26.54,31.11 26.54,35.31 | 26.16,35.43 24.57,35.43
  Top 1.422: U1.1 15.75,16 16.1,16 16.1,15.85
  Top 1.676: D2.1 16.1,15.85
CLK  (via drill 0.25)
  Top 0.254: v64.77,61.09 69.85,63.37 76.07,63.37 76.45,66.55 80.64,66.55 81.03,66.42 85.72,66.42 85.72,59.31 J11.3
  Top 0.305: J4.3 J11.3
  Bottom 0.254: v64.77,61.09 64.77,48.9 64.9,48.51 64.9,46.48 J3.11
DEBUG1  (1 unrouted)
DEBUG2  (1 unrouted)
DEBUG3  (1 unrouted)
DEBUG4  (1 unrouted)
DEBUG5  (1 unrouted)
DEBUG6  (1 unrouted)
DEBUG7  (1 unrouted)
DEBUG8  (1 unrouted)
FLOW_CTL_IN  (via drill 0.25 pad 0.61)  (1 unrouted)
  Bottom 0.254: v77.47,36.96 67.56,36.96 J3.17
FLOW_CTL_OUT  (via drill 0.25 pad 0.61)  (1 unrouted)
  Bottom 0.254: v78.36,29.34 67.06,29.34 J3.23
GND  (via drill 0.25, 0.25 pad 0.25, 0.5 pad 0.25, 0.8)
  Top 0.254: J3.2 68.71,59.82 | v64.13,48.26 63.88,48.39
  Top 0.406: 37.22,23.62 36.27,23.62 36.15,23.75 v35.69,23.75
  Top 0.61: 5.56,51.64 9.53,51.63 D1.A | C23.2 29.58,47.75 v28.07,47.75 | C25.2 25.9,22.35 24.89,21.97 24,20.19 v22.99,20.19
  Top 1.016: v35.69,23.75 35.69,26.01 U11.1 | 10.41,48.39 10.54,48.39 U2.3 U2.6 | 10.41,48.39 6.98,48.39 | 6.98,48.39 7.24,48.01 7.11,47.75 7.11,47.31 U2.5 | 6.98,48.39 v5.71,48.77 | 10.41,48.39 v10.13,48.03 | C24.2 29.08,33.4 28.57,33.91 v28.57,34.16
  Top 1.27: 18.62,18.41 C1.C | v35.69,23.75 34.55,23.75 C2.2
  Top 1.422: D1.A v5.71,50.67 v5.71,48.77
  Top 1.778: C5.- 17.78,46.48 v16,46.48
  Top 2.54: U2.6 10.79,31.5 v10.67,27.05 14.41,27.05 C4.-
  Bottom 0.254: 64.01,47.62 v64.13,48.26
  Bottom 0.61: v28.07,47.75 28.45,48.13 | v22.99,20.19 22.73,20.57
  Bottom 1.016: v28.57,34.16 28.57,35.05
  other vias: 29.34,23.62 26.54,64.01 26.54,62.99 28.07,62.99 28.07,64.01 29.59,64.01 29.59,62.99 17.14,64.01 15.62,64.01 15.62,62.99 17.14,62.99 18.67,62.99 18.67,64.01 20.45,60.45 24.51,60.45 31.37,57.4 35.43,57.4 19.68,7.87 21.21,7.87 22.73,7.87 22.73,6.86 21.21,6.86 19.68,6.86 13.84,11.43 17.4,11.43 29.08,17.27 29.08,16.26 30.61,16.26 30.61,17.27 32.13,17.27 32.13,16.26 21.72,16.51 26.8,16.51
  pour Bottom: 0.48,0.66 0.66,78.41 85.9,78.03 85.72,0.51
  pour Top: 0.64,78.23 0.64,0.64 15.37,0.64 85.34,0.76 84.96,78.11 20.57,78.23
  pour Top (no thermals): 26.29,64.26 29.84,64.26 29.84,64.01 29.84,62.74 26.29,62.74
  pour Top (no thermals): 15.37,64.26 18.92,64.26 18.92,64.01 18.92,62.74 15.37,62.74
  pour Top (no thermals): 19.43,8.13 22.99,8.13 22.99,7.87 22.99,6.6 19.43,6.6
  pour Top (no thermals): 28.83,17.53 32.39,17.53 32.39,16 28.83,16
GPIO-H1
  Top 0.254: J3.18 70.74,41.27 73.15,45.85 73.15,48.39 J16.5
GPIO-H2
  Top 0.254: J3.19 67.56,36.96 69.34,36.96 70.23,37.97 70.23,38.73 72.77,43.81 73.02,44.2 73.66,45.47 73.66,47.75 J16.6
GPIO-H3
  Top 0.254: J3.20 71.25,37.34 71.25,39.5 73.28,43.69 73.41,43.69 J16.7
GPIO-H4
  Top 0.254: J3.21 67.06,34.42 70.61,34.42 71.88,35.43 71.88,39.5 73.53,43.05 J16.8
GPIO-H5
  Top 0.254: J3.22 70.36,33.15 72.39,34.92 72.39,38.1 J16.9
GPIO-H7
  Top 0.254: J3.24 70.1,30.61 72.9,33.27 72.9,36.2 J16.10
GPIO-H8
  Top 0.254: J3.25 67.31,29.34 69.98,29.34 73.41,32.64 73.41,34.29 J16.11
GPIO-H9
  Top 0.254: J3.26 69.72,28.07 J16.12
GPIO-H10
  Top 0.254: J3.27 67.44,26.8 70.99,26.8 J16.13
GPIO-H11
  Top 0.254: J3.28 72.26,25.53 J16.14
GPIO-H12
  Top 0.254: J3.29 67.31,24.26 73.41,24.26 J16.15
GPIO-H13
  Top 0.254: J3.30 J16.16
GPIO-H14
  Top 0.254: J3.31 66.93,21.72 73.53,21.72 74.04,21.21 J16.17
GPIO-H15
  Top 0.254: J16.18 72.9,20.45 J3.32
HC_DIG_L1  (1 unrouted)
HC_DIG_L2  (1 unrouted)
HC_DIG_L3  (1 unrouted)
HC_DIG_R1  (1 unrouted)
HC_DIG_R2  (1 unrouted)
HC_DIG_R3  (1 unrouted)
HCA_L1  (1 unrouted)
HCA_L2  (1 unrouted)
HCA_R1  (1 unrouted)
HCA_R2  (1 unrouted)
HCA_R3  (1 unrouted)
ICSP_CLK  (1 unrouted)
ICSP_DATA  (1 unrouted)
LCA_L1  (1 unrouted)
LCA_L2  (1 unrouted)
LCA_L3  (1 unrouted)
LCA_L4  (1 unrouted)
LCA_L5  (1 unrouted)
LCA_R1  (1 unrouted)
LCA_R2  (1 unrouted)
LCA_R3  (1 unrouted)
LCA_R4  (1 unrouted)
LEGO_1A
  Top 0.305: U15.7 17.64,69.08 18.41,69.85 23.49,69.85 24.26,71.12 J2.1
LEGO_1B
  Top 0.305: U15.9 16.64,69.35 17.91,70.61 22.99,70.61 23.24,70.87 23.24,72.14 24,72.9 24,73.41 24.51,73.66 J2.2
LEGO_2A  (via drill 0.25)
  Top 0.305: U3.7 28.57,66.79 v28.32,67.31
  Bottom 0.305: v28.32,67.31 28.57,68.33 28.57,70.61 J2.3
LEGO_2B  (via drill 0.25)
  Top 0.305: U3.9 27.56,66.8 27.56,66.79 v26.8,67.3
  Bottom 0.305: v26.8,67.3 26.8,72.4 J2.4
LEGO_4A  (via drill 0.25)
  Top 0.305: v30.1,12.95 U5.7
  Bottom 0.305: J1.4 28.07,9.91 30.1,12.19 v30.1,12.95
LEGO_4B
  Top 0.305: J1.3 29.34,6.35 29.34,10.92 31.11,12.7 U5.9
LEGO_MOTOR_1A  (1 unrouted)
LEGO_MOTOR_1B  (1 unrouted)
LEGO_MOTOR_2A  (1 unrouted)
LEGO_MOTOR_2B  (1 unrouted)
LEGO_MOTOR_3A  (1 unrouted)
LEGO_MOTOR_3B  (1 unrouted)
LEGO_MOTOR_4A  (1 unrouted)
LEGO_MOTOR_4B  (1 unrouted)
MISO
  Top 0.305: J4.2 J11.2
  Bottom 0.254: J3.10 70.23,49.66 76.33,49.66 77.47,51.44 83.95,51.44 84.96,52.7 84.96,55.88 J11.2
MOSI  (via drill 0.25 pad 0.61)
  Top 0.254: J3.9 67.31,47.24 68.07,47.12 70.36,47.12 72.14,48.39 72.14,50.42 72.9,51.56 v72.9,52.2
  Top 0.305: J4.1 83.27,54.23 83.27,53.91 83.69,53.91 J11.1
  Bottom 0.254: v72.9,52.2 81.03,52.2 J11.1
N$1
  Top 1.016: U2.2 12.24,48.72 13.59,49.53 L1.1
  Top 2.54: D1.C 13.21,53.85 L1.1
N$3  (via drill 0.6)
  Top 0.305: 38.73,57.4 40.64,57.4 D6.2
  Top 0.406: v38.73,59.94 38.73,57.4 | v42.8,59.94 42.8,57.4
  Bottom 0.305: J6.14 40.51,71.12
  Bottom 0.406: 40.51,71.12 39.5,70.1 39.5,60.71 v38.73,59.94 | v42.8,59.94 42.8,60.71 42.04,61.47 42.04,69.85 J6.14
N$5  (1 unrouted)
N$6
  Top 0.305: D6.1 39.5,64.14 39.5,64.26 39.75,64.26
  Top 0.406: 39.5,64.26 39.5,69.85 J6.11 36.96,69.85 36.96,65.02 37.72,64.26 39.5,64.26
  Top 1.27: J6.2 J6.5 J6.8 J6.11
N$12  (3 unrouted)
  Top 0.406: D4.1 40.77,15.49 40.77,13.97 40.51,13.72 39.75,13.72 39.5,13.46 39.5,8.89 J20.11 36.96,8.89 36.96,15.24 37.21,15.49 40.26,15.49
N$14  (1 unrouted)
N$18
  Top 0.254: U14.19 41.74,42.12 C9.1
N$26
  Top 1.27: 3.43,15.39 4.37,15.39 D2.2
  Top 1.676: J5.1 4.47,64.39 1.47,64.39 1.5,16.18 1.65,15.41 3.43,15.39
N$31  (via drill 0.25)
  Top 0.305: U4.7 20.7,4.57 20.71,3.56 20.7,3.56 v20.7,3.05
  Bottom 0.305: v20.7,3.05 22.99,3.05 23.49,3.56 23.49,5.59 J1.2
N$32
  Top 0.305: U4.9 21.71,3.06 21.72,3.05 25.53,3.05 J1.1
N$34  (via drill 0.25)
  Top 0.254: U2.4 8.89,44.59 v8.89,46.99 | v8.89,56.08 8.13,56.08 8.13,59.56 R23.2 R22.1
  Bottom 0.254: v8.89,46.99 v8.89,56.08
N$37
  Top 0.305: C3.2 U14.10
N$39  (via drill 0.6 pad 0.25)  (3 unrouted)
  Top 0.406: 42.93,20.45 D4.2 | 38.86,20.19 40.39,22.48
  Bottom 0.406: J20.14 41.02,7.62 42.04,8.64 42.04,19.43 v42.93,20.32
  other vias: 38.86,20.32
N$40  (2 unrouted)
  Top 0.254: U9.8 U9.7
N$42  (1 unrouted)
RC_SERVO_1  (1 unrouted)
RC_SERVO_2  (1 unrouted)
RC_SERVO_3  (1 unrouted)
RC_SERVO_4  (1 unrouted)
RC_SERVO_5  (1 unrouted)
RC_SERVO_6  (1 unrouted)
RC_SERVO_7  (1 unrouted)
RC_SERVO_8  (1 unrouted)
RX0  (1 unrouted)
  Top 0.254: J3.4 69.72,56.9 70.36,57.4 76.45,57.4 78.36,55.37 78.36,45.97
RX1  (via drill 0.25 pad 0.61)
  Top 0.254: v71.37,48.9 71.37,49.66 70.1,50.93 70.1,52.96 69.6,53.47 J3.6
  Bottom 0.254: J12.4 82.42,48.01 79.76,48.01 79.25,47.88 76.58,47.24 71.5,47.24 71.37,47.37 v71.37,48.9
SCL  (4 unrouted)
SCL_BFIN  (1 unrouted)
SDA  (4 unrouted)
SDA_BFIN  (1 unrouted)
SPI_SEL
  Top 0.254: J3.12 70.61,45.85 72.64,47.24 72.64,49.4 73.66,50.93 73.66,52.7 J16.4
  Bottom 0.254: J16.4 77.6,53.47 77.6,60.71 82.17,60.71 82.17,61.72 J11.4
SPI_SEL2
  Top 0.254: 64.13,43.31 J3.13
TMR2
  Bottom 0.254: J3.7 67.44,52.2 69.47,52.2 72.39,55.12 72.39,58.42 73.02,58.93 73.02,60.83 73.41,61.21 J16.1
TMR3
  Bottom 0.254: J3.8 69.72,51.56 72.01,53.85 73.02,54.74 73.02,57.66 74.04,58.67 J16.2
TX0  (1 unrouted)
  Top 0.254: 77.85,45.09 77.85,54.74 67.56,54.74 J3.3
TX1  (via drill 0.25 pad 0.61)
  Top 0.254: J3.5 67.44,52.2 67.44,49.78 67.56,49.66 70.1,49.66 70.36,49.4 v70.36,48.26
  Bottom 0.254: v70.36,48.26 70.36,46.99 73.66,42.16 76.33,42.16 76.71,42.67 76.71,45.21 78.61,46.74 J12.3
(copper drawn outside any net)
  shapes: Top area x1

### Text on the board
tPlace: 1 | 2 | 3 | 4 | E | I | E | 1 | 2 | 3 | 4 | 1 | 2 | 3 | 4 | GND | SCL | LEGO | SDA | G | O | L | A | N | A | O | I | P | G | - | + | 1 | J3 | RCMX1 | 5V | GND | 1 | 5 | 32 | 2 | 6 | 3 | 7 | I | A | N | A | L | O | G | G | P | I | O | 4 | 8 | SDA | DEBUG | SCL | GND | 1 | 2 | 3 | 4 | E | 1 | 2 | 3 | 4 | 5 | 6 | 1 | 2 | 3 | 4